# Altium project PCB_Project.PrjPcb
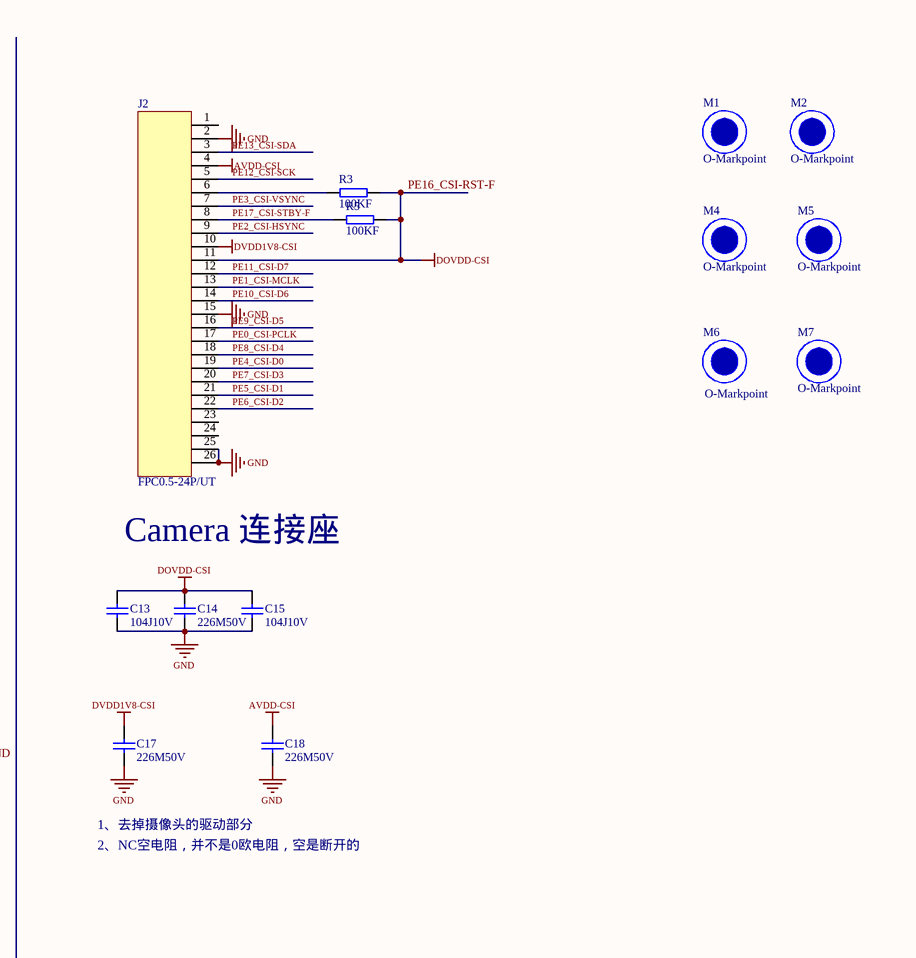
[diagram p0: robot.SchDoc, top right]
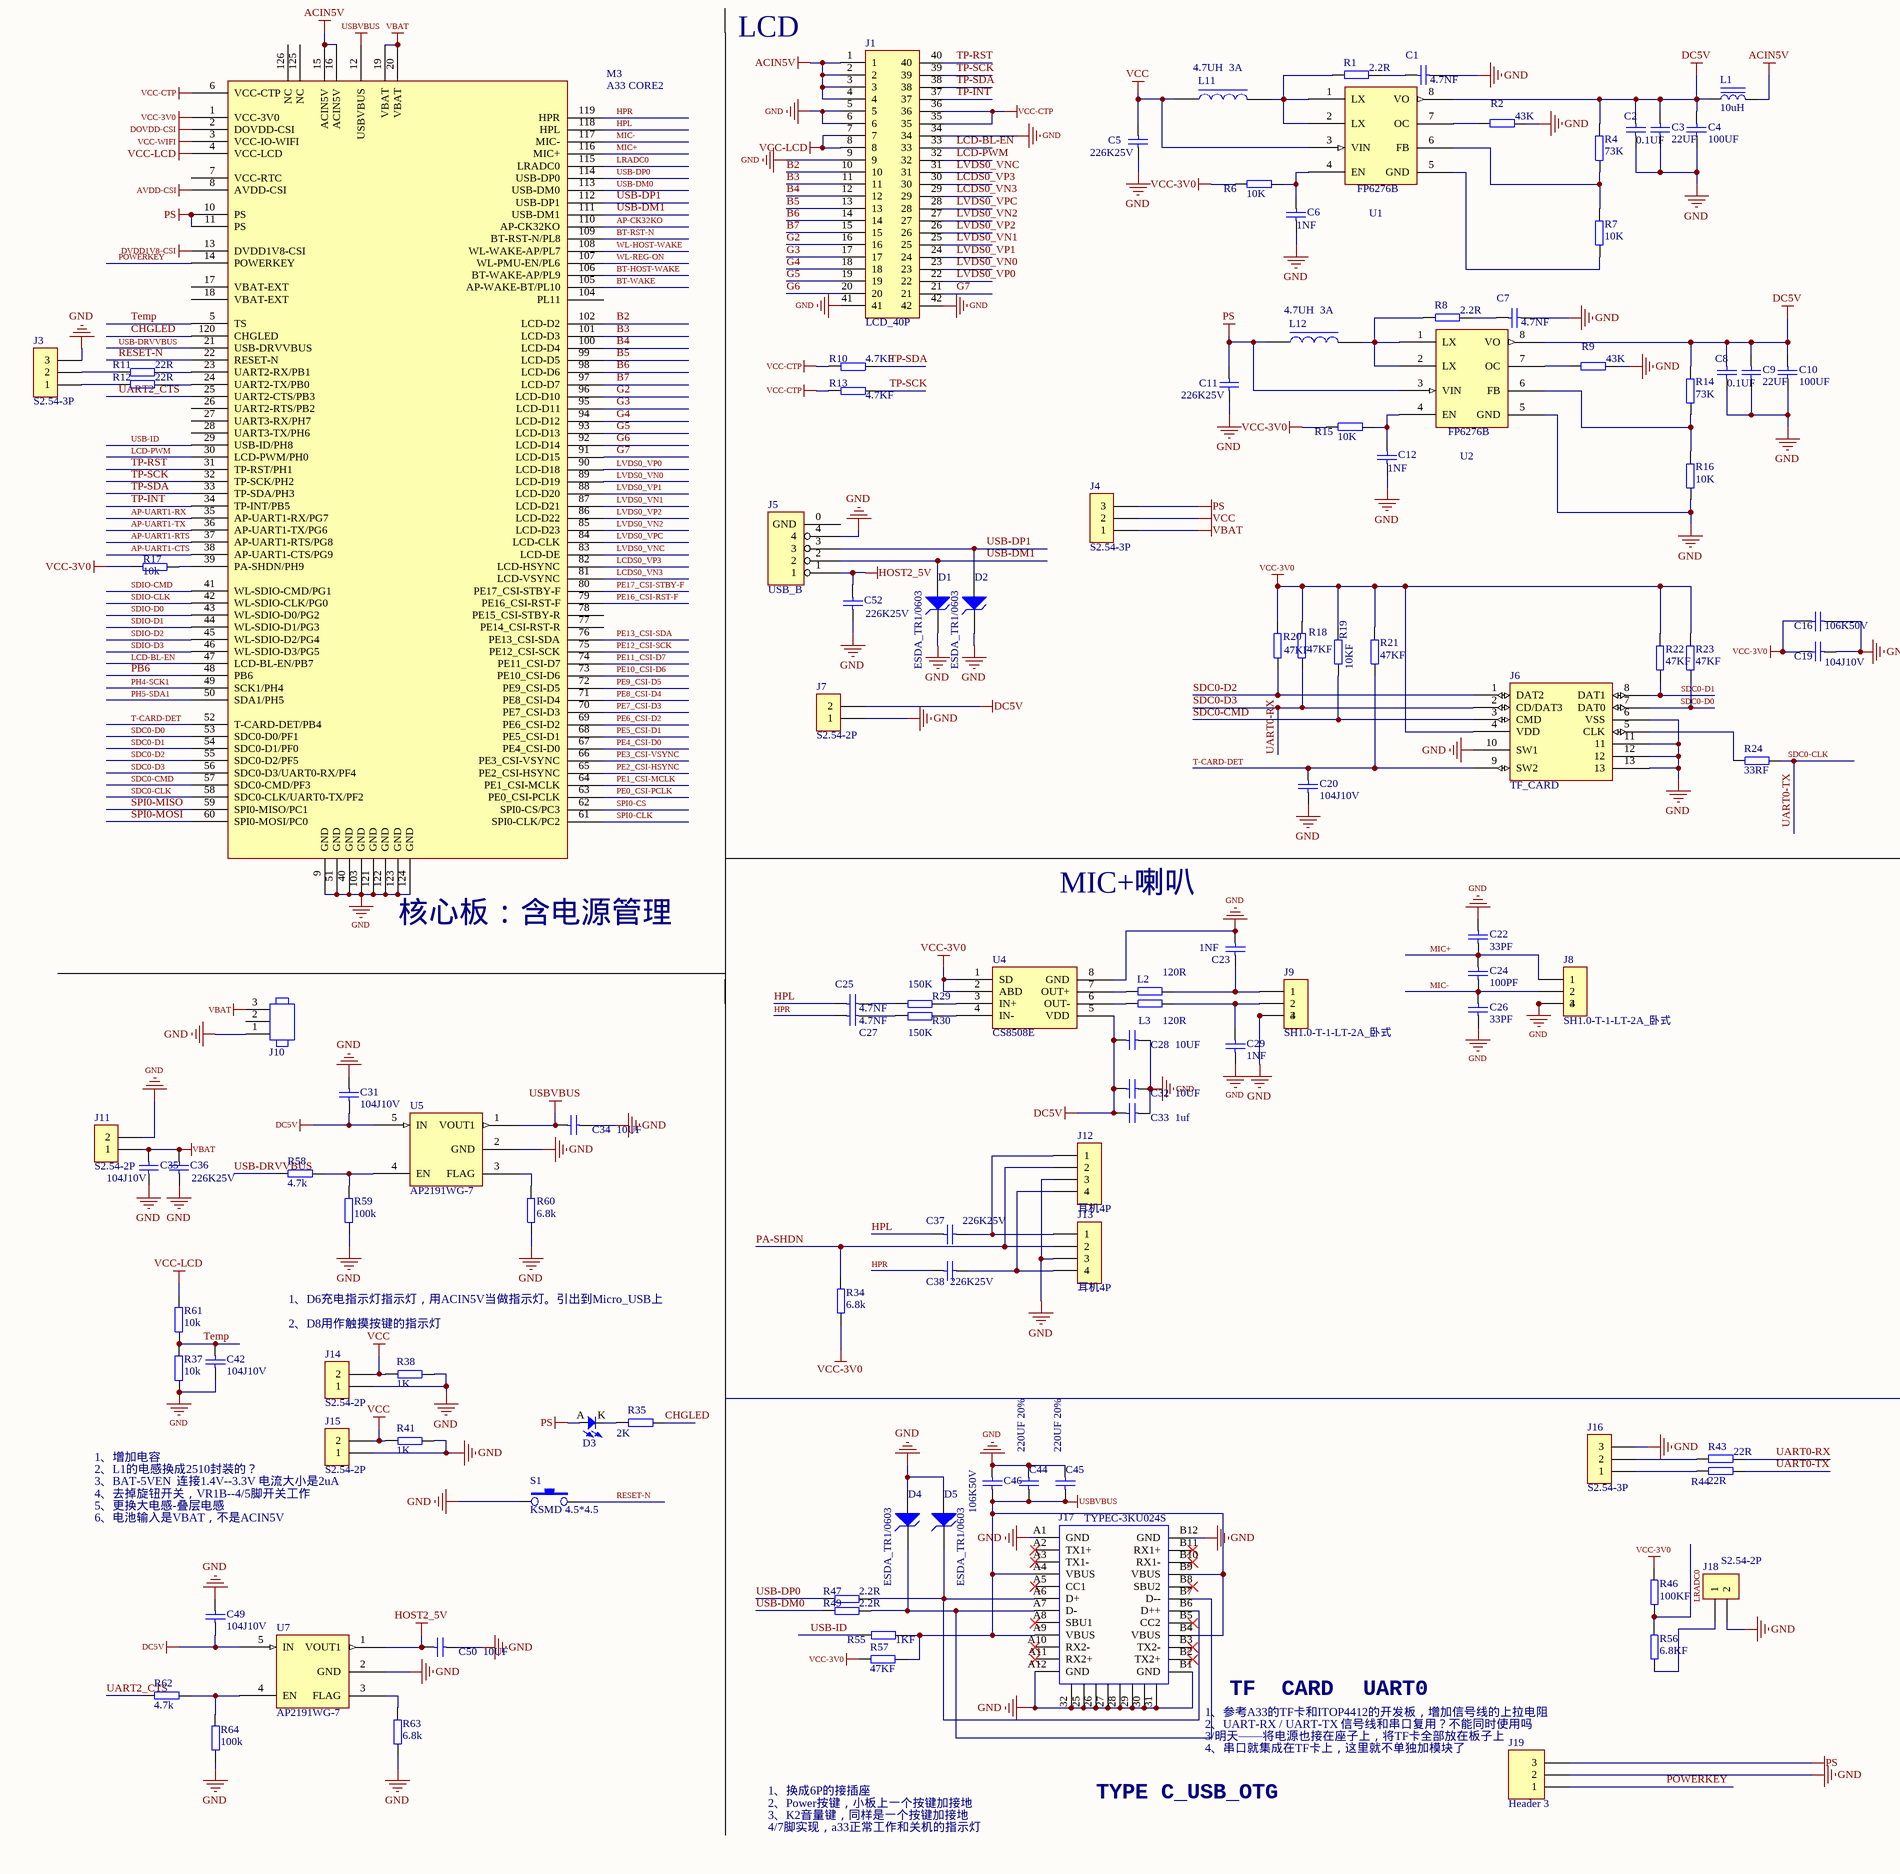
[diagram p1: robot.SchDoc, bottom left]
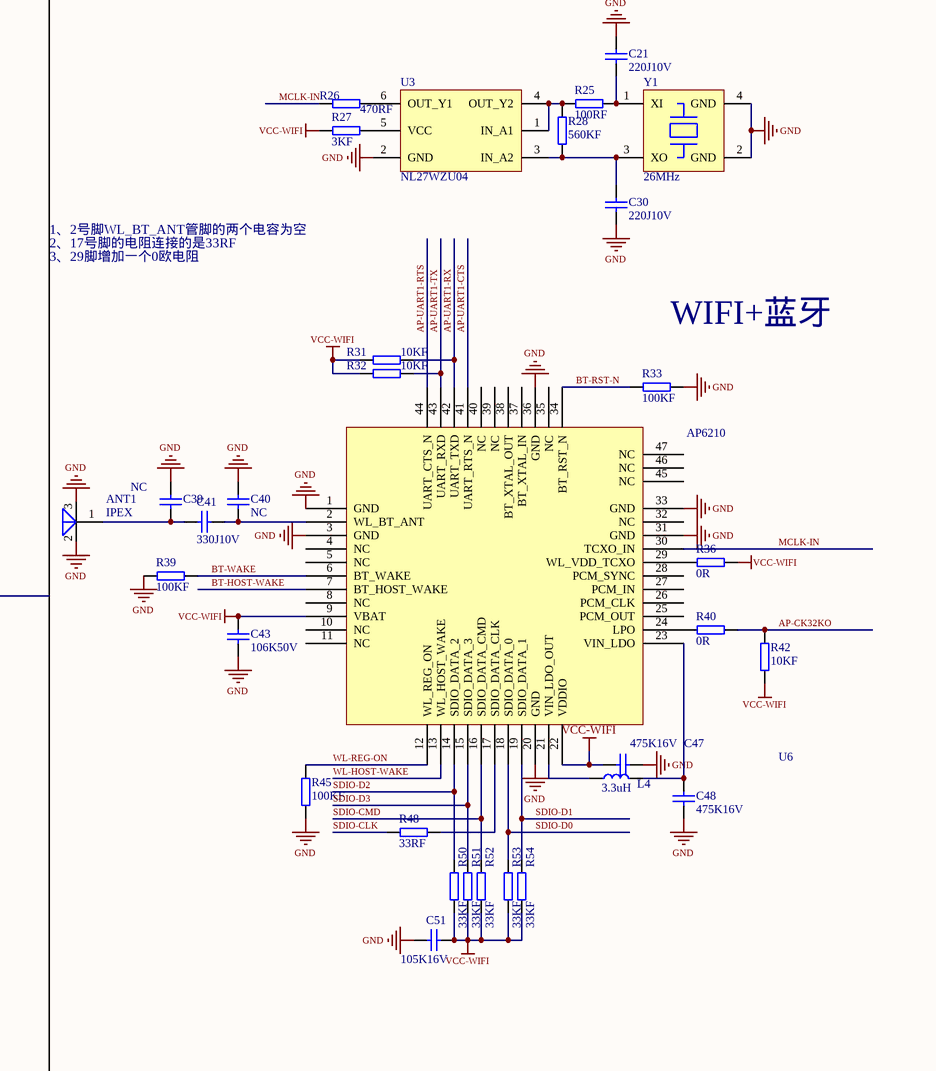
[diagram p2: robot.SchDoc, bottom right]
1 sheet, 163 parts. Net scope: global (net labels, ports and power ports of the same name join across sheets).
Board file: robot.PcbDoc

## Sheet robot.SchDoc
size A2

### Parts
ANT1  IPEX  [J-IPEX]
C1  4.7NF  [C0603]
C2  0.1UF  [C0402]
C3  22UF  [C0603]
C4  100UF  [CD3X5.3SMD]
C5  226K25V  [C0805]
C6  1NF  [C0402]
C7  4.7NF  [C0603]
C8  0.1UF  [C0402]
C9  22UF  [C0603]
C10  100UF  [CD3X5.3SMD]
C11  226K25V  [C0805]
C12  1NF  [C0402]
C13  104J10V  [C0402]
C14  226M50V  [C0805]
C15  104J10V  [C0402]
C16  106K50V  [C0603]
C17  226M50V  [C0805]
C18  226M50V  [C0805]
C19  104J10V  [C0402]
C20  104J10V  [C0402]
C21  220J10V  [C0402]
C22  33PF  [C0402]
C23  1NF  [C0402]
C24  100PF  [C0402]
C25  4.7NF  [C0603]
C26  33PF  [C0402]
C27  4.7NF  [C0603]
C28  10UF  [C0603]
C29  1NF  [C0402]
C30  220J10V  [C0402]
C31  104J10V  [C0402]
C32  10UF  [C0603]
C33  1uf  [C0603]
C34  10UF  [C0603]
C35  104J10V  [C0402]
C36  226K25V  [C0805]
C37  226K25V  [C0805]
C38  226K25V  [C0805]
C39  NC  [C0402]
C40  NC  [C0402]
C41  330J10V  [C0402]
C42  104J10V  [C0402]
C43  106K50V  [C0603]
C44  220UF 20%  [C1206]
C45  220UF 20%  [C1206]
C46  106K50V  [C0603]
C47  475K16V  [C0603]
C48  475K16V  [C0603]
C49  104J10V  [C0402]
C50  10UF  [C0603]
C51  105K16V  [C0603]
C52  226K25V  [C0805]
D1  ESDA_TR1/0603  [HS_0603D]
D2  ESDA_TR1/0603  [HS_0603D]
D3  发光二极管  [LED 3MM]  (value not drawn)
D4  ESDA_TR1/0603  [HS_0603D]
D5  ESDA_TR1/0603  [HS_0603D]
J1  LCD_40P  [LCD P40]
J2  FPC0.5-24P/UT  [FPC0.5-24P/UT]
J3  S2.54-3P  [S2.54-3P]
J4  S2.54-3P  [S2.54-3P]
J5  USB_B  [SMD USB A型]
J6  TF_CARD  [SD_CARD_7]
J7  S2.54-2P  [J-SH2.0-T-1-LT-2A_立式]
J8  SH1.0-T-1-LT-2A_卧式  [J-SH1.27-2]
J9  SH1.0-T-1-LT-2A_卧式  [J-SH1.27-2]
J10  SW  [拨码开关]  (value not drawn)
J11  S2.54-2P  [J-SH2.0-T-1-LT-2A_立式]
J12  耳机4P  [耳机接口]
J13  耳机4P  [耳机接口]
J14  S2.54-2P  [J-SH2.0-T-1-LT-2A_立式]
J15  S2.54-2P  [J-SH2.0-T-1-LT-2A_立式]
J16  S2.54-3P  [S2.54-3P]
J17  TYPEC-3KU024S  [MICRO -TYPE C]
J18  S2.54-2P  [S2.54-2P]
J19  Header 3  [J-SH1.27 - 3]
L1  10uH  [C0603]
L2  120R  [R0603]
L3  120R  [R0603]
L4  3.3uH  [L0805]
L11  (no value)  [电感SMD6*6*2.8]
L12  (no value)  [电感SMD6*6*2.8]
M1  O-Markpoint  [MarkGlobal1]
M2  O-Markpoint  [MarkGlobal1]
M3  A33 CORE2  [A33-CORE2]
M4  O-Markpoint  [MarkGlobal1]
M5  O-Markpoint  [MarkGlobal1]
M6  O-Markpoint  [MarkGlobal1]
M7  O-Markpoint  [MarkGlobal1]
R1  2.2R  [R0603]
R2  43K  [R0603]
R3  100KF  [R0603]
R4  73K  [R0603]
R5  100KF  [R0603]
R6  10K  [R0603]
R7  10K  [R0603]
R8  2.2R  [R0603]
R9  43K  [R0603]
R10  4.7KF  [R0402]
R11  22R  [R0603]
R12  22R  [R0603]
R13  4.7KF  [R0402]
R14  73K  [R0603]
R15  10K  [R0603]
R16  10K  [R0603]
R17  10k  [R0603]
R18  47KF  [R0603]
R19  10KF  [R0603]
R20  47KF  [R0603]
R21  47KF  [R0603]
R22  47KF  [R0603]
R23  47KF  [R0603]
R24  33RF  [R0603]
R25  100RF  [R0603]
R26  470RF  [R0603]
R27  3KF  [R0603]
R28  560KF  [R0603]
R29  150K  [R0603]
R30  150K  [R0603]
R31  10KF  [R0603]
R32  10KF  [R0603]
R33  100KF  [R0603]
R34  6.8k  [R0402]
R35  2K  [R0603]
R36  0R  [R0603]
R37  10k  [R0402]
R38  1K  [R0603]
R39  100KF  [R0603]
R40  0R  [R0603]
R41  1K  [R0603]
R42  10KF  [R0603]
R43  22R  [R0603]
R44  22R  [R0603]
R45  100KF  [R0603]
R46  100KF  [R0603]
R47  2.2R  [R0402]
R48  33RF  [R0603]
R49  2.2R  [R0402]
R50  33KF  [R0603]
R51  33KF  [R0603]
R52  33KF  [R0603]
R53  33KF  [R0603]
R54  33KF  [R0603]
R55  1KF  [R0603]
R56  6.8KF  [R0603]
R57  47KF  [R0603]
R58  4.7k  [R0402]
R59  100k  [R0402]
R60  6.8k  [R0402]
R61  10k  [R0402]
R62  4.7k  [R0402]
R63  6.8k  [R0402]
R64  100k  [R0402]
S1  KSMD 4.5*4.5  [侧按4.5*4.5*4.8]
U1  FP6276B  [U-SOP-8N-1]
U2  FP6276B  [U-SOP-8N-1]
U3  NL27WZU04  [U-TSOP-6]
U4  CS8508E  [U-SOP-8N-1]
U5  AP2191WG-7  [SOT23-5]
U6  AP6210  [AP6210]
U7  AP2191WG-7  [SOT23-5]
Y1  26MHz  [Y-CPX-32GA-4P]

### Nets
ACIN5V: J1.1 J1.2 J1.3 J1.4 L1.2 M3.15(ACIN5V) M3.16(ACIN5V)
AVDD-CSI: C18.1 J2.4 M3.8(AVDD-CSI)
DC5V: C2.1 C3.2 C4.2 C8.1 C9.2 C10.2 C28.1 C31.2 C32.1 C33.1 C49.2 J7.2 L1.1 R4.2 R14.2 U1.8(VO) U2.8(VO) U4.5(VDD) U5.5(IN) U7.5(IN)
DVDD1V8-CSI: C17.1 J2.10 M3.13(DVDD1V8-CSI)
GND: ANT1.2 ANT1.3 C1.2 C2.2 C3.1 C4.1 C5.1 C6.2 C7.2 C8.2 C9.1 C10.1 C11.1 C12.2 C13.2 C14.2 C15.2 C16.1 C17.2 C18.2 C19.1 C20.2 C21.2 C22.1 C23.2 C26.2 C28.2 C29.2 C30.2 C31.1 C32.2 C33.2 C34.2 C35.2 C36.2 C39.1 C40.1 C42.2 C43.2 C44.2 C45.2 C46.1 C47.1 C48.1 C49.1 C50.2 C51.2 C52.2 D1.2(K) D2.2(K) D4.1(A) D5.1(A) J1.5 J1.6 J1.9 J1.34 J1.41 J1.42 J2.2 J2.15 J2.25 J2.26 J3.3 J5.4 J6.6(VSS) J6.10(SW1) J6.11 J6.12 J6.13 J7.1 J8.3 J8.4 J9.3 J9.4 J10.1 J11.2 J12.3 J13.3 J14.1 J15.1 J16.3 J17.25 J17.26(B13) J17.27(B14) J17.28(B15) J17.29(B16) J17.30(B17) J17.31(B18) J17.32(B13) J17.A1(GND) J17.A12(GND) J17.B1(GND) J17.B12(GND) J18.2 J19.2 M3.9(GND) M3.40(GND) M3.51(GND) M3.103(GND) M3.121(GND) M3.122(GND) M3.123(GND) M3.124(GND) R2.1 R9.1 R16.1 R33.2 R37.1 R38.2 R39.2 R41.2 R45.2 R59.1 R60.1 R63.2 R64.2 S1.1 U2.5(GND) U3.2(GND) U4.8(GND) U5.2(GND) U6.1(GND) U6.3(GND) U6.20(GND) U6.31(GND) U6.33(GND) U6.36(GND) U7.2(GND) Y1.2(GND) Y1.4(GND)
HOST2_5V: C50.1 C52.1 J5.1 U7.1(VOUT1)
PE16_CSI-RST-F: C13.1 C14.1 C15.1 J2.11 M3.2(DOVDD-CSI) M3.79(PE16_CSI-RST-F) R3.1 R5.2  [also labelled DOVDD-CSI]
PS: C11.2 D3.A J4.3 J19.3 L12.1 M3.10(PS) M3.11(PS) U2.3(VIN)
USBVBUS: C34.1 C44.1 C45.1 C46.2 J17.A4(VBUS) J17.A9(VBUS) J17.B4(VBUS) J17.B9(VBUS) M3.12(USBVBUS) R55.2 R57.1 U5.1(VOUT1)
VBAT: C35.1 C36.1 J4.1 J10.3 J11.1 M3.19(VBAT) M3.20(VBAT)
VCC: C5.2 J4.2 J14.2 J15.2 L11.1 R38.1 R41.1 U1.3(VIN)
VCC-3V0: C16.2 C19.2 J6.4(VDD) M3.1(VCC-3V0) R6.2 R15.2 R17.1 R18.2 R19.2 R20.2 R21.2 R22.2 R23.2 R34.2 R46.1 R57.2 U4.1(SD) U4.2(ABD)
VCC-CTP: J1.35 J1.36 M3.6(VCC-CTP) R10.1 R13.1
VCC-LCD: J1.7 J1.8 M3.4(VCC-LCD) R61.2
VCC-WIFI: C43.1 C47.2 C51.1 M3.3(VCC-IO-WIFI) R27.1 R31.1 R32.1 R36.2 R42.1 R50.1 R51.1 R52.1 R53.1 R54.1 U6.9(VBAT) U6.22(VDDIO)
AP-CK32KO: M3.110(AP-CK32KO) R40.2 R42.2
AP-UART1-CTS: M3.38(AP-UART1-CTS/PG9) U6.41(UART_RTS_N)
AP-UART1-RTS: M3.37(AP-UART1-RTS/PG8) U6.44(UART_CTS_N)
AP-UART1-RX: M3.35(AP-UART1-RX/PG7) R31.2 U6.42(UART_TXD)
AP-UART1-TX: M3.36(AP-UART1-TX/PG6) R32.2 U6.43(UART_RXD)
B2: J1.10 M3.102(LCD-D2)
B3: J1.11 M3.101(LCD-D3)
B4: J1.12 M3.100(LCD-D4)
B5: J1.13 M3.99(LCD-D5)
B6: J1.14 M3.98(LCD-D6)
B7: J1.15 M3.97(LCD-D7)
BT-HOST-WAKE: M3.106(BT-WAKE-AP/PL9) U6.7(BT_HOST_WAKE)
BT-RST-N: M3.109(BT-RST-N/PL8) R33.1 U6.34(BT_RST_N)
BT-WAKE: M3.105(AP-WAKE-BT/PL10) R39.1 U6.6(BT_WAKE)
CHGLED: M3.120(CHGLED) R35.2
G2: J1.16 M3.96(LCD-D10)
G3: J1.17 M3.95(LCD-D11)
G4: J1.18 M3.94(LCD-D12)
G5: J1.19 M3.93(LCD-D13)
G6: J1.20 M3.92(LCD-D14)
G7: J1.21 M3.91(LCD-D15)
HPL: C25.1 C37.1 M3.118(HPL)
HPR: C27.1 C38.1 M3.119(HPR)
LCD-BL-EN: J1.33 M3.47(LCD-BL-EN/PB7)
LCD-PWM: J1.32 M3.30(LCD-PWM/PH0)
LCDS0_VN3: J1.29 M3.81(LCD-VSYNC)
LCDS0_VP3: J1.30 M3.82(LCD-HSYNC)
LRADC0: M3.115(LRADC0) R46.2 R56.1
LVDS0_VN0: J1.23 M3.89(LCD-D19)
LVDS0_VN1: J1.25 M3.87(LCD-D21)
LVDS0_VN2: J1.27 M3.85(LCD-D23)
LVDS0_VNC: J1.31 M3.83(LCD-DE)
LVDS0_VP0: J1.22 M3.90(LCD-D18)
LVDS0_VP1: J1.24 M3.88(LCD-D20)
LVDS0_VP2: J1.26 M3.86(LCD-D22)
LVDS0_VPC: J1.28 M3.84(LCD-CLK)
MCLK-IN: R26.1 U6.30(TCXO_IN)
MIC+: C22.2 C24.1 J8.1 M3.116(MIC+)
MIC-: C24.2 C26.1 J8.2 M3.117(MIC-)
PA-SHDN: J12.2 J13.2 R34.1
PB6: M3.48(PB6)
PE0_CSI-PCLK: J2.17 M3.63(PE0_CSI-PCLK)
PE1_CSI-MCLK: J2.13 M3.64(PE1_CSI-MCLK)
PE2_CSI-HSYNC: J2.9 M3.65(PE2_CSI-HSYNC)
PE3_CSI-VSYNC: J2.7 M3.66(PE3_CSI-VSYNC)
PE4_CSI-D0: J2.19 M3.67(PE4_CSI-D0)
PE5_CSI-D1: J2.21 M3.68(PE5_CSI-D1)
PE6_CSI-D2: J2.22 M3.69(PE6_CSI-D2)
PE7_CSI-D3: J2.20 M3.70(PE7_CSI-D3)
PE8_CSI-D4: J2.18 M3.71(PE8_CSI-D4)
PE9_CSI-D5: J2.16 M3.72(PE9_CSI-D5)
PE10_CSI-D6: J2.14 M3.73(PE10_CSI-D6)
PE11_CSI-D7: J2.12 M3.74(PE11_CSI-D7)
PE12_CSI-SCK: J2.5 M3.75(PE12_CSI-SCK)
PE13_CSI-SDA: J2.3 M3.76(PE13_CSI-SDA)
PE17_CSI-STBY-F: J2.8 M3.80(PE17_CSI-STBY-F) R5.1
PH4-SCK1: M3.49(SCK1/PH4)
PH5-SDA1: M3.50(SDA1/PH5)
POWERKEY: J19.1 M3.14(POWERKEY)
RESET-N: M3.22(RESET-N) S1.2
SDC0-CLK: M3.58(SDC0-CLK/UART0-TX/PF2) R24.1 R44.1  [also labelled UART0-TX]
SDC0-CMD: J6.3(CMD) M3.57(SDC0-CMD/PF3) R19.1
SDC0-D0: J6.7(DAT0) M3.53(SDC0-D0/PF1) R23.1
SDC0-D1: J6.8(DAT1) M3.54(SDC0-D1/PF0) R22.1
SDC0-D2: J6.1(DAT2) M3.55(SDC0-D2/PF5) R20.1
SDC0-D3: J6.2(CD/DAT3) M3.56(SDC0-D3/UART0-RX/PF4) R18.1 R43.1  [also labelled UART0-RX]
SDIO-CLK: M3.42(WL-SDIO-CLK/PG0) R48.2
SDIO-CMD: M3.41(WL-SDIO-CMD/PG1) R52.2 U6.16(SDIO_DATA_CMD)
SDIO-D0: M3.43(WL-SDIO-D0/PG2) R53.2 U6.18(SDIO_DATA_0)
SDIO-D1: M3.44(WL-SDIO-D1/PG3) R54.2 U6.19(SDIO_DATA_1)
SDIO-D2: M3.45(WL-SDIO-D2/PG4) R50.2 U6.14(SDIO_DATA_2)
SDIO-D3: M3.46(WL-SDIO-D3/PG5) R51.2 U6.15(SDIO_DATA_3)
SPI0-CLK: M3.61(SPI0-CLK/PC2)
SPI0-CS: M3.62(SPI0-CS/PC3)
SPI0-MISO: M3.59(SPI0-MISO/PC1)
SPI0-MOSI: M3.60(SPI0-MOSI/PC0)
T-CARD-DET: C20.1 J6.9(SW2) M3.52(T-CARD-DET/PB4) R21.1
Temp: C42.1 M3.5(TS) R37.2 R61.1
TP-INT: J1.37 M3.34(TP-INT/PB5)
TP-RST: J1.40 M3.31(TP-RST/PH1)
TP-SCK: J1.39 M3.32(TP-SCK/PH2) R13.2
TP-SDA: J1.38 M3.33(TP-SDA/PH3) R10.2
UART2_CTS: M3.25(UART2-CTS/PB3) R62.2
USB-DM0: M3.113(USB-DM0) R49.1
USB-DM1: D1.1(A) J5.2 M3.111(USB-DM1)
USB-DP0: M3.114(USB-DP0) R47.1
USB-DP1: D2.1(A) J5.3 M3.112(USB-DP1)
USB-DRVVBUS: M3.21(USB-DRVVBUS) R58.2
USB-ID: M3.29(USB-ID/PH8) R55.1
WL-HOST-WAKE: M3.108(WL-WAKE-AP/PL7) U6.13(WL_HOST_WAKE)
WL-REG-ON: M3.107(WL-PMU-EN/PL6) R45.1 U6.12(WL_REG_ON)
NetANT1_1: ANT1.1(W) C39.2 C41.2
NetC1_1: C1.1 R1.1
NetC6_1: C6.1 R6.1 U1.4(EN)
NetC7_1: C7.1 R8.1
NetC12_1: C12.1 R15.1 U2.4(EN)
NetC21_1: C21.1 R25.2 Y1.1(XI)
NetC23_1: C23.1 J9.1 L2.1
NetC25_2: C25.2 R29.1
NetC27_2: C27.2 R30.1
NetC29_1: C29.1 J9.2 L3.1
NetC30_1: C30.1 R28.1 U3.3(IN_A2) Y1.3(XO)
NetC37_2: C37.2 J12.1 J13.1
NetC38_2: C38.2 J12.4 J13.4
NetC40_2: C40.2 C41.1 U6.2(WL_BT_ANT)
NetC48_2: C48.2 L4.2 U6.23(VIN_LDO)
NetD3_K: D3.K R35.1
NetD4_2: D4.2(K) J17.A7(D-) J17.B7(D--) R49.2
NetD5_2: D5.2(K) J17.A6(D+) J17.B6(D++) R47.2
NetJ2_6: J2.6 R3.2
NetJ3_1: J3.1 R12.2
NetJ3_2: J3.2 R11.2
NetJ6_5: J6.5(CLK) R24.2
NetJ16_1: J16.1 R44.2
NetJ16_2: J16.2 R43.2
NetJ18_1: J18.1 R56.2
NetL2_2: L2.2 U4.7(OUT+)
NetL3_2: L3.2 U4.6(OUT-)
NetL4_1: L4.1 U6.21(VIN_LDO_OUT)
NetL11_2: L11.2 R1.2 U1.1(LX) U1.2(LX)
NetL12_2: L12.2 R8.2 U2.1(LX) U2.2(LX)
NetM3_23: M3.23(UART2-RX/PB1) R11.1
NetM3_24: M3.24(UART2-TX/PB0) R12.1
NetM3_39: M3.39(PA-SHDN/PH9) R17.2
NetR2_2: R2.2 U1.7(OC)
NetR4_1: R4.1 R7.2 U1.6(FB)
NetR7_1: R7.1 U1.5(GND)
NetR9_2: R9.2 U2.7(OC)
NetR14_1: R14.1 R16.2 U2.6(FB)
NetR25_1: R25.1 R28.2 U3.1(IN_A1) U3.4(OUT_Y2)
NetR26_2: R26.2 U3.6(OUT_Y1)
NetR27_2: R27.2 U3.5(VCC)
NetR29_2: R29.2 U4.3(IN+)
NetR30_2: R30.2 U4.4(IN-)
NetR36_1: R36.1 U6.29(WL_VDD_TCXO)
NetR40_1: R40.1 U6.24(LPO)
NetR48_1: R48.1 U6.17(SDIO_DATA_CLK)
NetR58_1: R58.1 R59.2 U5.4(EN)
NetR60_2: R60.2 U5.3(FLAG)
NetR62_1: R62.1 R64.1 U7.4(EN)
NetR63_1: R63.1 U7.3(FLAG)

Not connected (* = marked no-connect by the designer): J2 1 23 24; J5 0(GND); J10 2(1); J17 A2(TX1+)* A3(TX1-)* A5(CC1)* A8(SBU1)* A10(RX2-)* A11(RX2+)* B2(TX2+)* B3(TX2-)* B5(CC2)* B8(SBU2)* B10(RX1-)* B11(RX1+)*; M3 7(VCC-RTC) 17(VBAT-EXT) 18(VBAT-EXT) 26(UART2-RTS/PB2) 27(UART3-RX/PH7) 28(UART3-TX/PH6) 77(PE14_CSI-RST-R) 78(PE15_CSI-STBY-R) 104(PL11) 125(NC) 126(NC); U6 4(NC) 5(NC) 8(NC) 10(NC) 11(NC) 25(PCM_OUT) 26(PCM_CLK) 27(PCM_IN) 28(PCM_SYNC) 32(NC) 35(NC) 37(BT_XTAL_IN) 38(BT_XTAL_OUT) 39(NC) 40(NC) 45(NC) 46(NC) 47(NC)

### Notes on the sheet
- LCD
- Camera 连接座
- 1、去掉摄像头的驱动部分
- 2、NC空电阻，并不是0欧电阻，空是断开的
- (near M3) 核心板：含电源管理
- MIC+喇叭
- 1、2号脚WL_BT_ANT管脚的两个电容为空
- 2、17号脚的电阻连接的是33RF
- 3、29脚增加一个0欧电阻
- WIFI+蓝牙
- 1、D6充电指示灯指示灯，用ACIN5V当做指示灯。引出到Micro_USB上
- 2、D8用作触摸按键的指示灯
- 1、增加电容
- 2、L1的电感换成2510封装的？
- 3、BAT-5VEN  连接1.4V--3.3V 电流大小是2uA
- 4、去掉旋钮开关，VR1B--4/5脚开关工作
- 5、更换大电感-叠层电感
- 6、电池输入是VBAT，不是ACIN5V
- (near J17) 1、参考A33的TF卡和ITOP4412的开发板，增加信号线的上拉电阻
- TF  CARD
- UART0
- 2、UART-RX / UART-TX 信号线和串口复用？不能同时使用吗
- 3/明天——将电源也接在座子上，将TF卡全部放在板子上
- 4、串口就集成在TF卡上，这里就不单独加模块了
- 1、换成6P的接插座
- 2、Power按键，小板上一个按键加接地
- 3、K2音量键，同样是一个按键加接地
- 4/7脚实现，a33正常工作和关机的指示灯
- TYPE C_USB_OTG
- (in symbol INDUCTANCE1) 4.7UH  3A

### Library data of the parts
ANT1 = J-IPEX: 天线接口IPEX
C1 C3 C4 C7 C9 C10 C25 C27 C28 C32-C34 C50 = C0603X7R-330J25V: 贴片电容-陶瓷; 规格型号: 33pF±5%_25V_X7R_C0603; 生产商: 风华 三星; 供应商: *; 备注: *
C2 C6 C8 C12 = C0402X7R-101J10V: 贴片电容-陶瓷; 规格型号: 100pF±5%_10V_X7R_C0402; 生产商: 风华 三星; 供应商: *; 备注: *
C5 C11 C36-C38 C52 = C0805X7R-226K25V: 贴片电容-陶瓷; 规格型号: 22uF±10%_25V_X7R_C0805; 生产商: 风华 三星; 供应商: *; 备注: *
C13 C15 C19 C20 C22 C24 C26 C31 C35 C42 C49 = C0402X7R-104J10V: 贴片电容-陶瓷; 规格型号: 100nF±5%_10V_X7R_C0402; 生产商: 风华 三星; 供应商: *; 备注: *
C14 C17 C18 = C0805Y5V-226M50V: 贴片电容-陶瓷; 规格型号: 22uF±20%_50V_Y5V_C0805; 生产商: 风华 三星; 供应商: *; 备注: *
C16 C43 C46 = C0603X7R-106K50V: 贴片电容-陶瓷; 规格型号: 10uF±10%_50V_X7R_C0603; 生产商: 风华 三星; 供应商: *; 备注: *
C21 C23 C29 C30 C39 C40 = C0402X7R-220J10V: 贴片电容-陶瓷; 规格型号: 22pF±5%_10V_X7R_C0402; 生产商: 风华 三星; 供应商: *; 备注: *
C41 = C0402X7R-330J10V: 贴片电容-陶瓷; 规格型号: 33pF±5%_10V_X7R_C0402; 生产商: 风华 三星; 供应商: *; 备注: *
C44 C45 = C1206-A型 极性电容: C 1206钽电容 --220UF 10V 3216 A型 有极性电容 3.2mm X 1.6mm; 参数: C 1206钽电容 --220UF 20% 10V 3216 A型 有极性 白色为正 电容 3.2mm X 1.6mm
C47 C48 = C0603X7R-475K16V: 贴片电容-陶瓷; 规格型号: 4.7uF±10%_16V_X7R_C0603; 生产商: 风华 三星; 供应商: *; 备注: *
C51 = C0603X7R-105K16V: 贴片电容-陶瓷; 规格型号: 1uF±10%_16V_X7R_C0603; 生产商: 风华 三星; 供应商: *; 备注: *
D1 D2 D4 D5 = D Zener: Zener Diode; Published: *; LatestRevisionDate: *; LatestRevisionNote: *; PackageReference: *; Publisher: *
J2 = J-FPC0.5-24P/UT: FPC端子; 规格型号: FPC0.5-24P/UT 24P 脚间距0.5mm 上接触 推进式; 货品编码: 样品无编码; 供应商: *; 备注: *
J3 J4 J16 = J-S2.54-3P: 单排排针-直针; 货品编码: 372015; 供应商: *; 规格型号: S2.54-3P; 备注: *
J6 = TF_CARD: MS110-C10B-C16
J7 J11 J14 J15 J18 = J-S2.54-2P: 单排排针-直针; 货品编码: 372013; 供应商: *; 规格型号: S2.54-2P; 备注: *
J10 = 卡槽-3
J12 J13 = J-S2.54-4P: 单排排针-直针; 货品编码: 样品无编码; 供应商: *; 规格型号: S2.54-4P; 备注: *
J17 = TYPEC-3KU024S: DIP Switch; Published: 24-Mar-1999; LatestRevisionDate: 17-Jul-2002; LatestRevisionNote: Re-released for DXP Platform.; PackageReference: DIP-18; Publisher: Altium Limited; Code_JEDEC: MO-036-AE
J19 = Header 3: Header, 3-Pin; LatestRevisionDate: 17-Jul-2002; LatestRevisionNote: Re-released for DXP Platform.; Publisher: Altium Limited
L1 = LI-0608-10uH1A: 插件电感-工形; 货品编码: 无样品无编码; 生产商: *; 规格型号: LI-0608-10uH1A; 供应商: *; 备注: *
L2 L3 R18 R20-R23 R57 = R0603-47KF: 贴片电阻-通用; 生产商: 厚声 国巨; 规格型号: 47K±1%_1/10W_±200ppm_R0603; 货品编码: 无样品无编码; 备注: *; 供应商: *
L4 = L-0805-3.3uH: 贴片电感-层叠; 规格型号: L0805-3.3uH; 生产商: *; 供应商: *; 备注: *
L11 L12 = INDUCTANCE1
M1 M2 M4-M7 = O-Markpoint: MARK点
R1 R2 R4 R6-R9 R14-R16 R38 R41 = R0603-2KF: 贴片电阻-通用; 生产商: 厚声 国巨; 规格型号: 2K±1%_1/10W_±200ppm_R0603; 备注: *; 供应商: *
R3 R5 R11 R12 R33 R39 R43-R46 = R0603-100KF: 贴片电阻-通用; 生产商: 厚声 国巨; 规格型号: 100K±1%_1/10W_±200ppm_R0603; 货品编码: 无样品无编码; 备注: *; 供应商: *
R10 R13 = R0402-4.7KF: 贴片电阻-通用
R17 R19 R29-R32 R42 = R0603-10KF: 贴片电阻-通用; 生产商: 厚声 国巨; 规格型号: 10K±1%_1/10W_±200ppm_R0603; 备注: *; 供应商: *
R24 R48 = R0603-33RF: 贴片电阻-通用; 生产商: 厚声 国巨; 规格型号: 33R±1%_1/10W_±200ppm_R0603; 货品编码: 无样品无编码; 备注: *; 供应商: *
R25 = R0603-100RF: 贴片电阻-通用; 生产商: 厚声 国巨; 规格型号: 100R±1%_1/10W_±200ppm_R0603; 备注: *; 供应商: *
R26 = R0603-470RF: 贴片电阻-通用; 生产商: 厚声 国巨; 规格型号: 470R±1%_1/10W_±200ppm_R0603; 货品编码: 无样品无编码; 备注: *; 供应商: *
R27 R35 = R0603-3KF: 贴片电阻-通用; 生产商: 厚声 国巨; 规格型号: 3K±1%_1/10W_±200ppm_R0603; 货品编码: 无样品无编码; 备注: *; 供应商: *
R28 = R0603-560KF: 贴片电阻-通用; 生产商: 厚声 国巨; 规格型号: 560K±1%_1/10W_±200ppm_R0603; 备注: *; 供应商: *
R34 R37 R47 R49 R58-R64 = R0402-1KF: 贴片电阻-通用; 生产商: 厚声 国巨; 规格型号: 1K±1%_1/10W_±200ppm_R0402; 备注: *; 供应商: *
R36 R40 = R0603-0R: 贴片电阻-通用; 生产商: 厚声 国巨; 规格型号: 0R_1/10W_±200ppm_R0603; 货品编码: 无样品无编码; 备注: *; 供应商: *
R50-R54 = R0603-33KF: 贴片电阻-通用; 生产商: 厚声 国巨; 规格型号: 33K±1%_1/10W_±200ppm_R0603; 备注: *; 供应商: *
R55 = R0603-1KF: 贴片电阻-通用; 生产商: 厚声 国巨; 规格型号: 1K±1%_1/10W_±200ppm_R0603; 货品编码: 无样品无编码; 备注: *; 供应商: *
R56 = R0603-6.8KF: 贴片电阻-通用; 生产商: 厚声 国巨; 规格型号: 6.8K±1%_1/10W_±200ppm_R0603; 货品编码: 无样品无编码; 备注: *; 供应商: *
S1 = S-KSMD6X6-4P: 轻触按键; 货品编码: 232013; 规格型号: 6x6 SMD贴片按键; 备注: *; 供应商: *; 生产商: *
U1 U2 = FP6267B
Y1 = YC-26MHz: 晶振-贴片无源; 规格型号: 26MHz_贴片晶振3225; 生产商: *; 供应商: *; 备注: *